# Altium schematic sheet Air_Purification_System.SchDoc: Air Purification System
size A4; DrawnBy: Yuting Zuo; Engineer: Yuting Zuo; Address1: 2014212711; Address2: 左宇婷; DocumentNumber: 1; Revision: V2.0; SheetNumber: 1; SheetTotal: 1; DocumentFullPathAndName: D:\Destop\..\Air_Purification_System
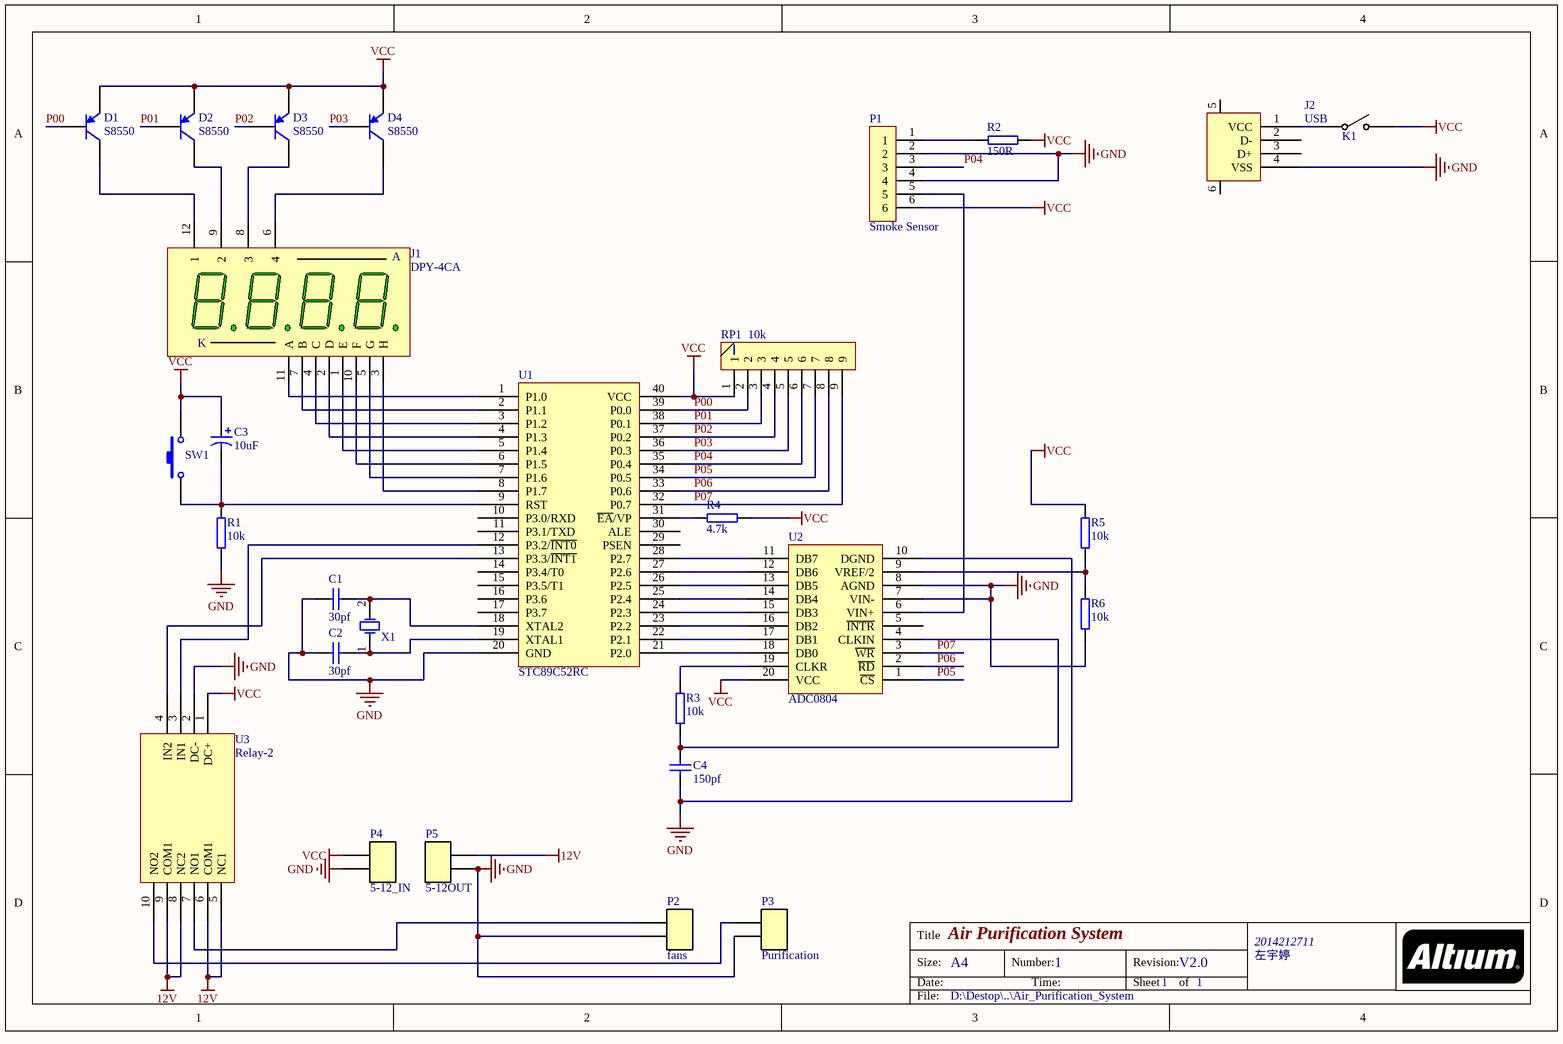
[diagram p0: Air_Purification_System.SchDoc]

## Parts
C1  Cap  [cap:42:250]  (value not drawn)
C2  Cap  [cap:42:250]  (value not drawn)
C3  value 10uF  [CAP:POL:42,100]  (hidden comment: Cap Pol)
C4  Cap  [cap:42:250]  (value not drawn)
D1  S8550  [S8550]
D2  S8550  [S8550]
D3  S8550  [S8550]
D4  S8550  [S8550]
J1  DPY-4CA  [DYP-4BIT]
J2  USB  [USB_A1]
K1  SW  [SWITCH DPDT]  (value not drawn)
P1  Smoke Sensor  [6P X1]
P2  fans  [HDR2.54-1X2]
P3  Purification  [HDR2.54-1X2]
P4  5-12_IN  [HDR2.54-1X2]
P5  5-12OUT  [HDR2.54-1X2]
R1  Res  [电阻mil:42:380]  (value not drawn)
R2  Res  [电阻mil:42:380]  (value not drawn)
R3  Res  [电阻mil:42:380]  (value not drawn)
R4  Res  [电阻mil:42:380]  (value not drawn)
R5  Res  [电阻mil:42:380]  (value not drawn)
R6  Res  [电阻mil:42:380]  (value not drawn)
RP1  排阻  [排阻]  (value not drawn)
SW1  四脚按键  [四脚按键mil:42:210:300]  (value not drawn)
U1  STC89C52RC  [DIP-40-2]
U2  ADC0804  [DIP-20]
U3  Relay-2  [PCBComponent_1]
X1  晶振  [晶振]  (value not drawn)

## Nets
12V: P5.2 U3.5(NC1) U3.6(COM1) U3.8(NC2) U3.9(COM1)
GND: C1.1 C2.1 C4.1 J2.4(VSS) P1.2 P1.4 P2.2 P3.2 P4.2 P5.1 R1.2 R6.1 U1.20(GND) U2.7(VIN-) U2.8(AGND) U2.10(DGND) U3.2(DC-)
VCC: C3.1 D1.1(E) D2.1(E) D3.1(E) D4.1(E) K1.1(NO) P1.6 P4.1 R2.2 R4.1 R5.2 RP1.1 SW1.4 U1.40(VCC) U2.20(VCC) U3.1(DC+)
P00: D1.2(B) RP1.2 U1.39(P0.0)
P01: D2.2(B) RP1.3 U1.38(P0.1)
P02: D3.2(B) RP1.4 U1.37(P0.2)
P03: D4.2(B) RP1.5 U1.36(P0.3)
P04: P1.3 RP1.6 U1.35(P0.4)
P05: RP1.7 U1.34(P0.5) U2.1(~{CS})
P06: RP1.8 U1.33(P0.6) U2.2(~{RD})
P07: RP1.9 U1.32(P0.7) U2.3(~{WR})
NetC1_2: C1.2 U1.18(XTAL2) X1.2(OSC2)
NetC2_2: C2.2 U1.19(XTAL1) X1.1(OSC1)
NetC3_2: C3.2 R1.1 SW1.1 U1.9(RST)
NetC4_2: C4.2 R3.1 U2.4(CLKIN)
NetD1_3: D1.3(C) J1.12(1)
NetD2_3: D2.3(C) J1.9(2)
NetD3_3: D3.3(C) J1.8(3)
NetD4_3: D4.3(C) J1.6(4)
NetJ1_1: J1.1(E) U1.5(P1.4)
NetJ1_2: J1.2(D) U1.4(P1.3)
NetJ1_3: J1.3(H) U1.8(P1.7)
NetJ1_4: J1.4(C) U1.3(P1.2)
NetJ1_5: J1.5(G) U1.7(P1.6)
NetJ1_7: J1.7(B) U1.2(P1.1)
NetJ1_10: J1.10(F) U1.6(P1.5)
NetJ1_11: J1.11(A) U1.1(P1.0)
NetJ2_1: J2.1(VCC) K1.2(COMMON)
NetP1_1: P1.1 R2.1
NetP1_5: P1.5 U2.6(VIN+)
NetP2_1: P2.1 U3.7(NO1)
NetP3_1: P3.1 U3.10(NO2)
NetR3_2: R3.2 U2.19(CLKR)
NetR4_2: R4.2 U1.31(~{EA}/VP)
NetR5_1: R5.1 R6.2 U2.9(VREF/2)
NetU1_12: U1.12(P3.2/~{INT0}) U3.3(IN1)
NetU1_13: U1.13(P3.3/~{INT1}) U3.4(IN2)
NetU1_21: U1.21(P2.0) U2.18(DB0)
NetU1_22: U1.22(P2.1) U2.17(DB1)
NetU1_23: U1.23(P2.2) U2.16(DB2)
NetU1_24: U1.24(P2.3) U2.15(DB3)
NetU1_25: U1.25(P2.4) U2.14(DB4)
NetU1_26: U1.26(P2.5) U2.13(DB5)
NetU1_27: U1.27(P2.6) U2.12(DB6)
NetU1_28: U1.28(P2.7) U2.11(DB7)

Not connected (* = marked no-connect by the designer): J2 2(D-) 3(D+) 5 6; SW1 2 3; U1 10(P3.0/RXD) 11(P3.1/TXD) 14(P3.4/T0) 15(P3.5/T1) 16(P3.6) 17(P3.7) 29(PSEN) 30(ALE); U2 5(~{INTR})

## Notes on the sheet
- Title
- Size:
- Date:
- A4
- Number:
- Time:
- Revision:
- Sheet
- of
- File:
- (in symbol Cap) 30pf; 150pf
- (in symbol DPY-4CA) K
- (in symbol Res) 10k; 150R; 4.7k
- (in symbol 排阻) 10k

## Library data of the parts
J1 = DPY-4CA: 共阳4位数码管
J2 = USB: USB接口
K1 = SW: 六角开关
P1 = 6P X1
P2-P5 = Pin 2: 接插件
U1 = STC89C52RC: MCU
U2 = ADC0804: ADC
U3 = Component_1
C3 = Cap Pol: name: Cap Pol